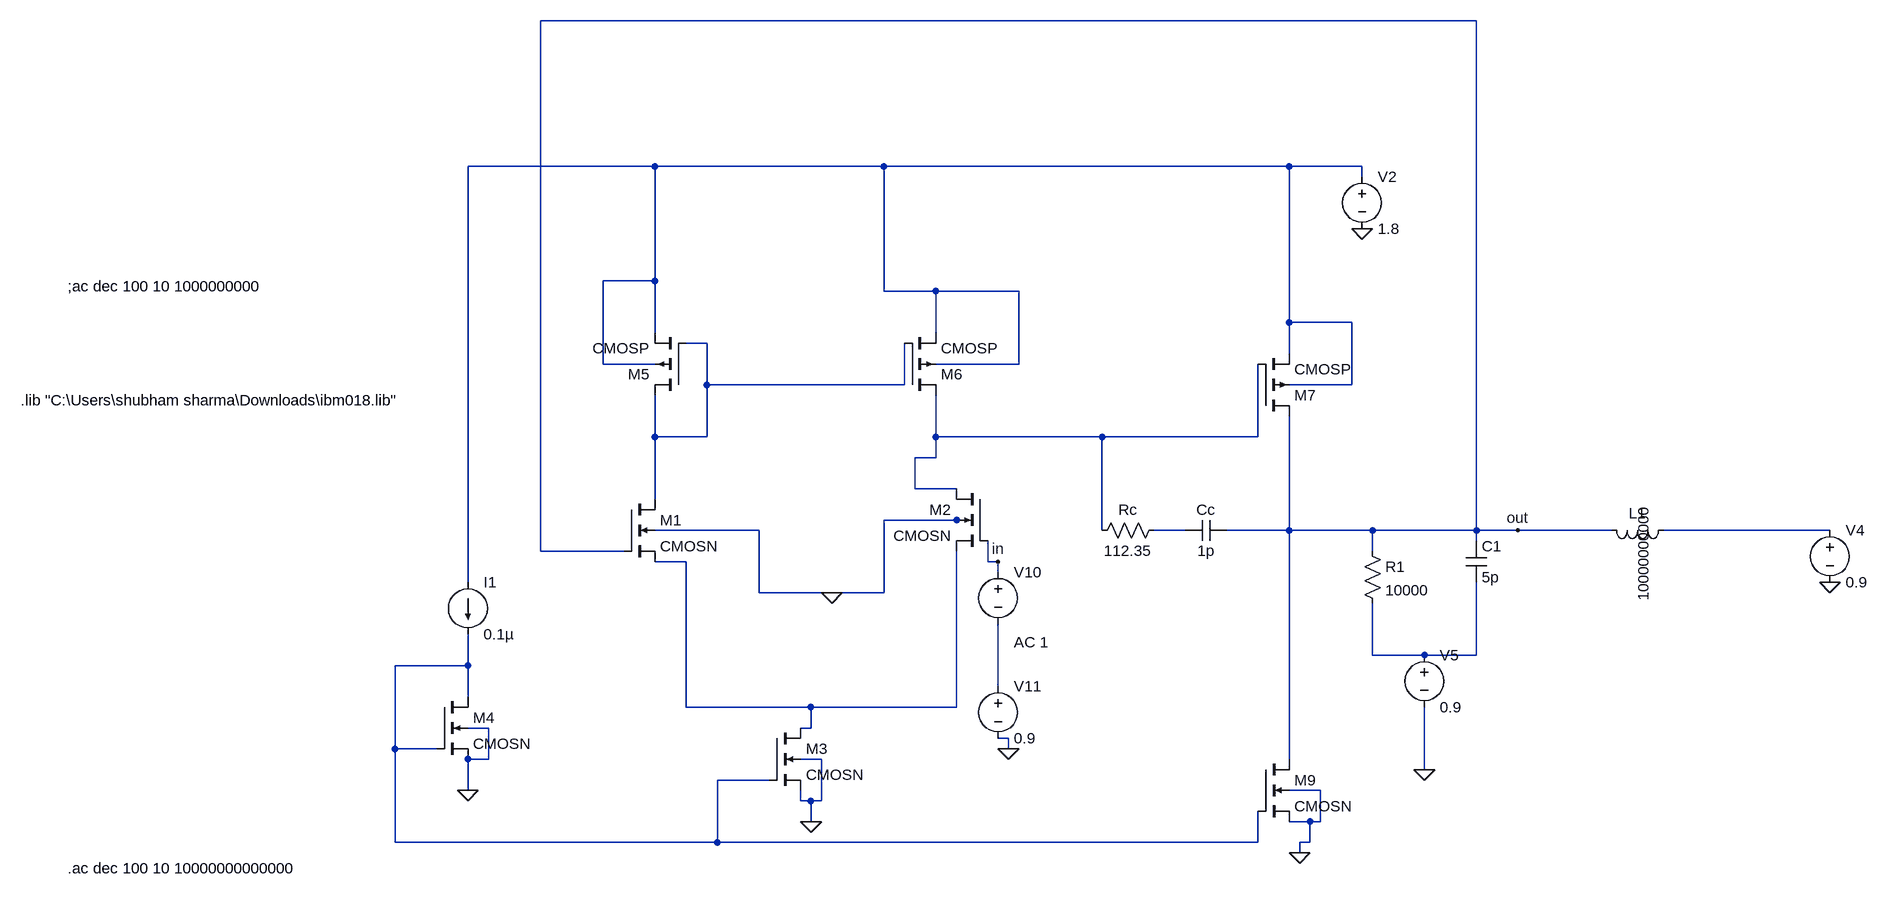
[diagram p0: schematic High_frequency_Projectt.asc]
High_frequency_Projectt.asc, the LTspice schematic file:
Version 4
SHEET 1 3852 1252
WIRE 1408 -224 -32 -224
WIRE 144 0 -144 0
WIRE 496 0 144 0
WIRE 1120 0 496 0
WIRE 1232 0 1120 0
WIRE 1232 16 1232 0
WIRE 144 176 144 0
WIRE 144 176 64 176
WIRE 496 192 496 0
WIRE 576 192 496 192
WIRE 704 192 576 192
WIRE 1120 240 1120 0
WIRE 1216 240 1120 240
WIRE 144 256 144 176
WIRE 576 256 576 192
WIRE 224 272 192 272
WIRE 1120 288 1120 240
WIRE 64 304 64 176
WIRE 144 304 64 304
WIRE 704 304 704 192
WIRE 704 304 576 304
WIRE 224 336 224 272
WIRE 528 336 528 272
WIRE 528 336 224 336
WIRE 1216 336 1216 240
WIRE 1216 336 1120 336
WIRE 144 416 144 352
WIRE 224 416 224 336
WIRE 224 416 144 416
WIRE 576 416 576 352
WIRE 832 416 576 416
WIRE 1072 416 1072 304
WIRE 1072 416 832 416
WIRE 576 448 576 416
WIRE 576 448 544 448
WIRE 544 496 544 448
WIRE 608 496 544 496
WIRE 144 512 144 416
WIRE 608 544 496 544
WIRE 624 544 608 544
WIRE 304 560 144 560
WIRE 832 560 832 416
WIRE 960 560 912 560
WIRE 1120 560 1120 384
WIRE 1120 560 1024 560
WIRE 1248 560 1120 560
WIRE 1408 560 1408 -224
WIRE 1408 560 1248 560
WIRE 1472 560 1408 560
WIRE 1616 560 1472 560
WIRE 1952 560 1696 560
WIRE 1408 576 1408 560
WIRE -32 592 -32 -224
WIRE 96 592 -32 592
WIRE 1248 592 1248 560
WIRE 192 608 144 608
WIRE 656 608 656 576
WIRE 672 608 656 608
WIRE 672 624 672 608
WIRE -144 640 -144 0
WIRE 304 656 304 560
WIRE 416 656 304 656
WIRE 496 656 496 544
WIRE 496 656 416 656
WIRE 1248 752 1248 672
WIRE 1328 752 1248 752
WIRE 1408 752 1408 640
WIRE 1408 752 1328 752
WIRE -144 768 -144 720
WIRE -144 768 -256 768
WIRE 672 800 672 704
WIRE -144 816 -144 768
WIRE 192 832 192 608
WIRE 384 832 192 832
WIRE 608 832 608 592
WIRE 608 832 384 832
WIRE -112 864 -144 864
WIRE 384 864 384 832
WIRE 384 864 368 864
WIRE 688 880 672 880
WIRE -256 896 -256 768
WIRE -192 896 -256 896
WIRE 688 896 688 880
WIRE -112 912 -112 864
WIRE -112 912 -144 912
WIRE 400 912 368 912
WIRE 1120 912 1120 560
WIRE 1328 928 1328 832
WIRE 320 944 240 944
WIRE -144 960 -144 912
WIRE 1168 960 1120 960
WIRE 368 976 368 960
WIRE 384 976 368 976
WIRE 400 976 400 912
WIRE 400 976 384 976
WIRE 384 1008 384 976
WIRE 1152 1008 1120 1008
WIRE 1168 1008 1168 960
WIRE 1168 1008 1152 1008
WIRE -256 1040 -256 896
WIRE 240 1040 240 944
WIRE 240 1040 -256 1040
WIRE 1072 1040 1072 992
WIRE 1072 1040 240 1040
WIRE 1152 1040 1152 1008
WIRE 1152 1040 1136 1040
WIRE 1136 1056 1136 1040
FLAG 384 1008 0
FLAG -144 960 0
FLAG 1136 1056 0
FLAG 688 896 0
FLAG 1328 928 0
FLAG 1952 640 0
FLAG 416 656 0
FLAG 1232 96 0
FLAG 1472 560 out
FLAG 672 608 in
DATAFLAG 624 416 ""
DATAFLAG 1376 560 ""
DATAFLAG -144 0 ""
SYMBOL nmos4 96 512 R0
SYMATTR InstName M1
SYMATTR Value CMOSN
SYMATTR Value2 l=360n w=8.3u
SYMBOL nmos4 656 496 M0
SYMATTR InstName M2
SYMATTR Value CMOSN
SYMATTR Value2 l=360n w=8.3u
SYMBOL nmos4 320 864 R0
SYMATTR InstName M3
SYMATTR Value CMOSN
SYMATTR Value2 l=2700n w=79.72u
SYMBOL nmos4 -192 816 R0
SYMATTR InstName M4
SYMATTR Value CMOSN
SYMATTR Value2 l=2700n w=0.24u
SYMBOL current -144 640 R0
WINDOW 123 0 0 Left 0
WINDOW 39 0 0 Left 0
SYMATTR InstName I1
SYMATTR Value 0.1µ
SYMBOL nmos4 1072 912 R0
SYMATTR InstName M9
SYMATTR Value CMOSN
SYMATTR Value2 l=2700n w=1242.38u
SYMBOL res 928 544 R90
WINDOW 0 0 56 VBottom 2
WINDOW 3 32 56 VTop 2
SYMATTR InstName Rc
SYMATTR Value 112.35
SYMBOL cap 1024 544 R90
WINDOW 0 0 32 VBottom 2
WINDOW 3 32 32 VTop 2
SYMATTR InstName Cc
SYMATTR Value 1p
SYMBOL cap 1392 576 R0
SYMATTR InstName C1
SYMATTR Value 5p
SYMBOL res 1232 576 R0
SYMATTR InstName R1
SYMATTR Value 10000
SYMBOL voltage 672 608 R0
WINDOW 3 24 152 Left 2
WINDOW 123 24 124 Left 2
WINDOW 39 0 0 Left 0
SYMATTR Value ""
SYMATTR Value2 AC 1
SYMATTR InstName V10
SYMBOL voltage 672 784 R0
WINDOW 123 0 0 Left 0
WINDOW 39 0 0 Left 0
SYMATTR InstName V11
SYMATTR Value 0.9
SYMBOL voltage 1232 0 R0
WINDOW 123 0 0 Left 0
WINDOW 39 0 0 Left 0
SYMATTR InstName V2
SYMATTR Value 1.8
SYMBOL ind 1712 544 R90
WINDOW 0 5 56 VBottom 2
WINDOW 3 50 31 Top 2
SYMATTR InstName L1
SYMATTR Value 10000000000
SYMBOL voltage 1952 544 R0
WINDOW 123 0 0 Left 0
WINDOW 39 0 0 Left 0
SYMATTR InstName V4
SYMATTR Value 0.9
SYMBOL voltage 1328 736 R0
WINDOW 123 0 0 Left 0
WINDOW 39 0 0 Left 0
SYMATTR InstName V5
SYMATTR Value 0.9
SYMBOL pmos4 192 352 R180
SYMATTR InstName M5
SYMATTR Value CMOSP
SYMATTR Value2 l=360n w=33.22u
SYMBOL pmos4 528 352 M180
SYMATTR InstName M6
SYMATTR Value CMOSP
SYMATTR Value2 l=360n w=33.22u
SYMBOL pmos4 1072 384 M180
SYMATTR InstName M7
SYMATTR Value CMOSP
SYMATTR Value2 l=360n w=1035.33u
TEXT -760 184 Left 2 !;ac dec 100 10 1000000000
TEXT -760 1080 Left 2 !.ac dec 100 10 10000000000000
TEXT -832 360 Left 2 !.lib "C:\\Users\\shubham sharma\\Downloads\\ibm018.lib"

The netlist it stands for:
* High_frequency_Projectt.asc
M1 N002 out N006 0 CMOSN l=360n w=8.3u
M2 N003 in N006 0 CMOSN l=360n w=8.3u
M3 N006 N008 0 0 CMOSN l=2700n w=79.72u
M4 N008 N008 0 0 CMOSN l=2700n w=0.24u
I1 N001 N008 0.1µ
M9 out N008 0 0 CMOSN l=2700n w=1242.38u
Rc N004 N003 112.35
Cc out N004 1p
C1 out N007 5p
R1 out N007 10000
V10 in N009 AC 1
V11 N009 0 0.9
V2 N001 0 1.8
L1 N005 out 10000000000
V4 N005 0 0.9
V5 N007 0 0.9
M5 N002 N002 N001 N001 CMOSP l=360n w=33.22u
M6 N003 N002 N001 N001 CMOSP l=360n w=33.22u
M7 out N003 N001 N001 CMOSP l=360n w=1035.33u
.model NMOS NMOS
.model PMOS PMOS
.lib standard.mos
;ac dec 100 10 1000000000
.ac dec 100 10 10000000000000
.lib "C:\Users\shubham sharma\Downloads\ibm018.lib"
.backanno
.end